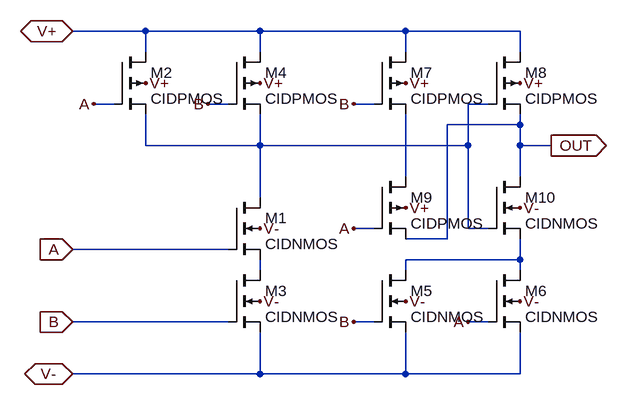
[diagram p0: schematic XNOR2x1.asc]
XNOR2x1.asc, the LTspice schematic file:
Version 4.1
SHEET 1 880 680
WIRE 16 -64 -96 -64
WIRE 192 -64 16 -64
WIRE 416 -64 192 -64
WIRE 592 -64 416 -64
WIRE 16 -32 16 -64
WIRE 192 -32 192 -64
WIRE 416 -32 416 -64
WIRE 592 -32 592 -64
WIRE -32 48 -64 48
WIRE 144 48 112 48
WIRE 368 48 336 48
WIRE 544 48 512 48
WIRE 592 80 592 64
WIRE 592 80 480 80
WIRE 16 112 16 64
WIRE 192 112 192 64
WIRE 192 112 16 112
WIRE 512 112 512 48
WIRE 512 112 192 112
WIRE 592 112 592 80
WIRE 640 112 592 112
WIRE 416 160 416 64
WIRE 592 160 592 112
WIRE 192 192 192 112
WIRE 368 240 336 240
WIRE 512 240 512 112
WIRE 544 240 512 240
WIRE 480 256 480 80
WIRE 480 256 416 256
WIRE 144 272 -96 272
WIRE 592 288 592 256
WIRE 592 288 416 288
WIRE 192 304 192 288
WIRE 416 304 416 288
WIRE 592 304 592 288
WIRE 144 384 -96 384
WIRE 368 384 336 384
WIRE 544 384 512 384
WIRE 192 464 192 400
WIRE 192 464 -96 464
WIRE 416 464 416 400
WIRE 416 464 192 464
WIRE 592 464 592 400
WIRE 592 464 416 464
FLAG -96 272 A
IOPIN -96 272 In
FLAG -64 48 A
FLAG -96 -64 V+
IOPIN -96 -64 BiDir
FLAG -96 464 V-
IOPIN -96 464 BiDir
FLAG 192 352 V-
FLAG -96 384 B
IOPIN -96 384 In
FLAG 112 48 B
FLAG 192 16 V+
FLAG 16 16 V+
FLAG 416 16 V+
FLAG 592 16 V+
FLAG 416 208 V+
FLAG 336 48 B
FLAG 336 384 B
FLAG 336 240 A
FLAG 512 384 A
FLAG 640 112 OUT
IOPIN 640 112 Out
FLAG 416 352 V-
FLAG 592 352 V-
FLAG 592 208 V-
FLAG 192 240 V-
SYMBOL nmos4 144 192 R0
SYMATTR InstName M1
SYMATTR Value CIDNMOS
SYMATTR Value2 l=5u w=10u
SYMBOL pmos4 -32 -32 R0
SYMATTR InstName M2
SYMATTR Value CIDPMOS
SYMATTR Value2 l=5u w=25u
SYMBOL nmos4 144 304 R0
SYMATTR InstName M3
SYMATTR Value CIDNMOS
SYMATTR Value2 l=5u w=10u
SYMBOL pmos4 144 -32 R0
SYMATTR InstName M4
SYMATTR Value CIDPMOS
SYMATTR Value2 l=5u w=25u
SYMBOL nmos4 368 304 R0
SYMATTR InstName M5
SYMATTR Value CIDNMOS
SYMATTR Value2 l=5u w=10u
SYMBOL nmos4 544 304 R0
SYMATTR InstName M6
SYMATTR Value CIDNMOS
SYMATTR Value2 l=5u w=10u
SYMBOL pmos4 368 -32 R0
SYMATTR InstName M7
SYMATTR Value CIDPMOS
SYMATTR Value2 l=5u w=25u
SYMBOL pmos4 544 -32 R0
SYMATTR InstName M8
SYMATTR Value CIDPMOS
SYMATTR Value2 l=5u w=25u
SYMBOL pmos4 368 160 R0
SYMATTR InstName M9
SYMATTR Value CIDPMOS
SYMATTR Value2 l=5u w=25u
SYMBOL nmos4 544 160 R0
SYMATTR InstName M10
SYMATTR Value CIDNMOS
SYMATTR Value2 l=5u w=10u

The netlist it stands for:
* XNOR2x1.asc
M1 N001 A N004 V- CIDNMOS l=5u w=10u
M2 V+ A N001 V+ CIDPMOS l=5u w=25u
M3 N004 B V- V- CIDNMOS l=5u w=10u
M4 V+ B N001 V+ CIDPMOS l=5u w=25u
M5 N003 B V- V- CIDNMOS l=5u w=10u
M6 N003 A V- V- CIDNMOS l=5u w=10u
M7 V+ B N002 V+ CIDPMOS l=5u w=25u
M8 V+ N001 OUT V+ CIDPMOS l=5u w=25u
M9 N002 A OUT V+ CIDPMOS l=5u w=25u
M10 OUT N001 N003 V- CIDNMOS l=5u w=10u
.model NMOS NMOS
.model PMOS PMOS
.lib standard.mos
.backanno
.end